# Altium project SIMPLE POWER.PrjPcb
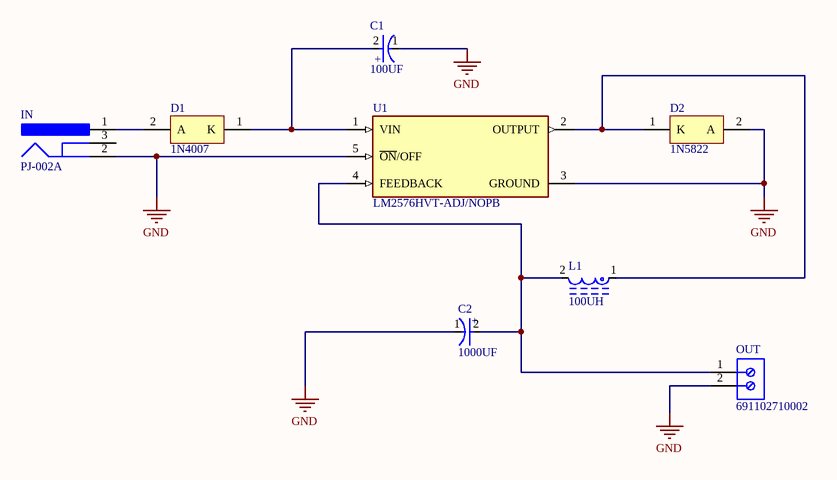
[diagram p0: Sheet1.SchDoc]
1 sheet, 8 parts. Net scope: global (net labels, ports and power ports of the same name join across sheets).
Board file: PCB1.PcbDoc

## Sheet Sheet1.SchDoc
size A4; SheetNumber: 1; SheetTotal: 1

### Parts
C1  100UF  [FP-RAD-TH-D_12_5_0_5-L_20-MFG]
C2  1000UF  [FP-RAD-TH-D_12_5_0_5-L_20-MFG]
D1  1N4007  [ONSC-AXIAL_LEAD-2-59-10_P]
D2  1N5822  [ONSC-AXIAL_LEAD-2-267-05_V]
IN  PJ-002A  [CUI-PJ-002A_V]
L1  100UH  [FP-RLB0914-MFG]
OUT  691102710002  [691102710002]
U1  LM2576HVT-ADJ/NOPB  [FP-KC0005A-MFG]

### Nets
GND: C1.1(C) C2.1(C) D2.2(A) IN.2 OUT.2 U1.3(GROUND) U1.5(~{ON}/OFF)
NetC1_2: C1.2(A) D1.1(K) U1.1(VIN)
NetC2_2: C2.2(A) L1.2 OUT.1 U1.4(FEEDBACK)
NetD1_2: D1.2(A) IN.1
NetD2_1: D2.1(K) L1.1 U1.2(OUTPUT)

Not connected (* = marked no-connect by the designer): IN 3

### Notes on the sheet
- (in symbol CMP-05427-001016-1) +

### Library data of the parts
C1 C2 = CMP-05427-001016-1: Aluminum Electrolytic Capacitors (Radial Lead Type) 1000uF ±20% 25V; Dissipation Factor: 0.22%; Life (Hours): 10000Hour; Ripple Current: 498mA; Lead/Base Style: Straight; Lead Diameter: 0.6mm; Leakage Current: 250uA; Capacitance: 1mF; Package Quantity: 200; Number of Pins: 2; Packaging: Bulk; Diameter: 12.5mm; Height - Seated (Max): 0.787inch; Voltage Rating (DC): 25V; Mount: Through Hole; Tolerance: 20%; Radiation Hardening: No; Voltage Rating: 25V; Height: 20mm; Construction: RADIAL; Min Operating Temperature: -40°C; Max Operating Temperature: 105°C; Series: EB; Length: 20mm; RoHS Compliant: Yes; Lead Free: Lead Free; REACH SVHC: No SVHC; Case/Package: Radial; Voltage: 25V; Termination: Radial; Lead Pitch: 5mm
D1 = CMP-0902-00142-1: Standard Recovery Rectifier, 2-Pin Axial_Lead, Pb-Free, Bulk Bag; Manufacturer: On Semiconductor; IO(rec) Max (A): 1; IFSM Max (A): 30; VRRM Max (V): 1000; ComponentLink3URL: http://www.onsemi.cn/pub_link/Collateral/59-10.PDF; PackageVersion: Rev. U, 02/2005; PackageDescription: 2-Pin, Axial Lead, Diameter 2.35 mm; PackageReference: AXIAL_LEAD-2-59-10; RoHS: TRUE; PartNumber: 1N4007; Packing: Bulk Bag; DatasheetVersion: Rev. 13; ComponentLink3Description: Package Specification; ComponentLink1Description: Manufacturer URL; ComponentLink2URL: http://www.onsemi.com/pub_link/Collateral/1N4001-D.PDF; ComponentLink1URL: http://www.onsemi.com/; Type: Standard Recovery; ComponentLink2Description: Datasheet; Mounting Technology: Through Hole
D2 = CMP-1055-00007-1: Rectifier, 2-Pin Axial_Lead, Bulk Bag; Manufacturer: On Semiconductor; IFSM Max (A): 80; Note1: 0; Configuration: Single; PartNumber: 1N5822; ComponentLink2Description: Datasheet; RoHS: FALSE; PackageDescription: 2-Pin, Axial Lead, Diameter 5.05 mm; Mounting Technology: Through Hole; PackageReference: AXIAL_LEAD-2-267-05; ComponentLink1URL: http://www.onsemi.com/; PackageVersion: Rev. G, 06/2000; ComponentLink2URL: http://www.onsemi.cn/pub_link/Collateral/1N5820-D.PDF; ComponentLink3Description: Package Specification; ComponentLink1Description: Manufacturer URL; ComponentLink3URL: http://www.onsemi.com/pub_link/Collateral/267-05.PDF; Packing: Bulk Bag; DatasheetVersion: Rev. 10
IN = CMP-2000-06895-2: Through Hole Right Angle DC Power Jack, 2.5 A, 2 mm Center Pin, 3 Position, -25 to 85 degC, RoHS, Bulk; Manufacturer: CUIInc.; Brand: CUI; Inside Contact Diameter: 2mm; Voltage Rating: 24V; Outside Contact Diameter: 6.5mm; Current Rating: 2.5A; Insulation Resistance: 50MOhms; Contact Gender: Male; Connector Type: DCPowerJack; Datasheet Version: Rev. 1.03, 04/2016; Housing Material: PolybutyleneTerephthalate(PBT); Operating Temperature Range: -25Cto+85C; Termination Style: ThroughHole; Product Category: DCPowerConnectors; Mounting Technology: ThroughHole; Mounting Style: ThroughHole; Factory Pack Quantity: 500; Contact Plating: Nickel; Package Reference: PJ-002A; Mounting Angle: Right; Package Description: 3-Pin Through Hole Device, Body 14.4 x 9 mm, Height 11 mm; Flammability Rating: UL94V-0; Manufacturer URL: http://www.cui.com/; Product: Jacks; Contact Material: Copper; Datasheet URL: http://www.cui.com/product/resource/pj-002a.pdf; RoHS: True
L1 = CMP-07248-000080-1: FIXED IND 100UH 1A 280 MOHM TH; Test Frequency: 796kHz; Material: Steel; Lead/Base Style: Radial; Tolerance: 10%; Resistance: 280mR; Lead Diameter: 0.65mm; Self Resonant Frequency: 3.5MHz; Q Factor: 30; Shielding: Unshielded; Core Material: Ferrite; Radiation Hardening: No; Inductance: 100uH; Mount: Through Hole; Current Rating: 1A; Series: RLB; Inductance Tolerance: 10%; Package Quantity: 200; DC Resistance (DCR): 280mR; Max Operating Temperature: 105°C; REACH SVHC: No SVHC; Height - Seated (Max): 0.512inch; Military Standard: Not; Packaging: Bulk; Termination: Radial; Min Operating Temperature: -20°C; Height: 12mm; Max DC Current: 1A; Diameter: 8.7mm; Resistor Type: Wirewound; Lead Pitch: 5mm; Length: 12mm; Case/Package: Radial; Orientation: Vertical; DC Current: 1A; RMS Current (Irms): 1A
OUT = CMP-1502-03258-1: Series 102 - 5.00 mm Horizontal Entry Modular with Pressure Clamp WR-TBL, 2 pin; Manufacturer: Wurth Elektronik; Pin Number: 2; Pitch: 5.00mm; Manufacturer URL: http://www.we-online.de; Mounting Technology: THT; Publisher: WurthElektronik; Packaging: Box; Package Reference: 691102710002; Datasheet URL: http://katalog.we-online.de/em/datasheet/6911027100xx.pdf; Operating Temperature: -40to105degC; Part Number: 691102710002
U1 = CMP-0069-01993-4: IC REG BUCK ADJ 3A TO220-5; Manufacturer: Texas Instruments; Number Of Outputs: 1; Switching Frequency: 52kHz; Output Type: AdjustableProgrammable; Max Junction Temp: +150°C; Max Supply Voltage: 60V; Max Duty Cycle: 98%; Output Voltage: 57V; Nominal Supply Current: 5-50uA; Description: Conv DC-DC Single Inv/Step Down 4V to 60V 5-Pin(5+Tab) TO-220; Lead Free: Yes; ComponentLink2Description: Datasheet; Temperature: -40°C to +125°C; Temperature Range High: +125°C; Temperature Range Low: -40°C; Manufacturer Part Number: LM2576HVT-ADJ/NOPB; Mouser Description: Switching Voltage Regulators 3A STEP-DOWN VLTG REG; Category: IC; Output Current: 3A; Height: 16.51mm; Automotive: No; Device Class L2: Power Management ICs; RoHS: TRUE; Package: KC0005A; Digikey Description: IC REG BUCK ADJ 3A TO220-5; ComponentLink2URL: http://www.ti.com/lit/ds/symlink/lm2576hv.pdf; Octopart: https://octopart.com/lm2576hvt-adj%2Fnopb-texas+instruments-24812812; Device Class L1: Integrated Circuits (ICs); Switching Topology: Buck; Device Class L3: Voltage Regulators - Switching